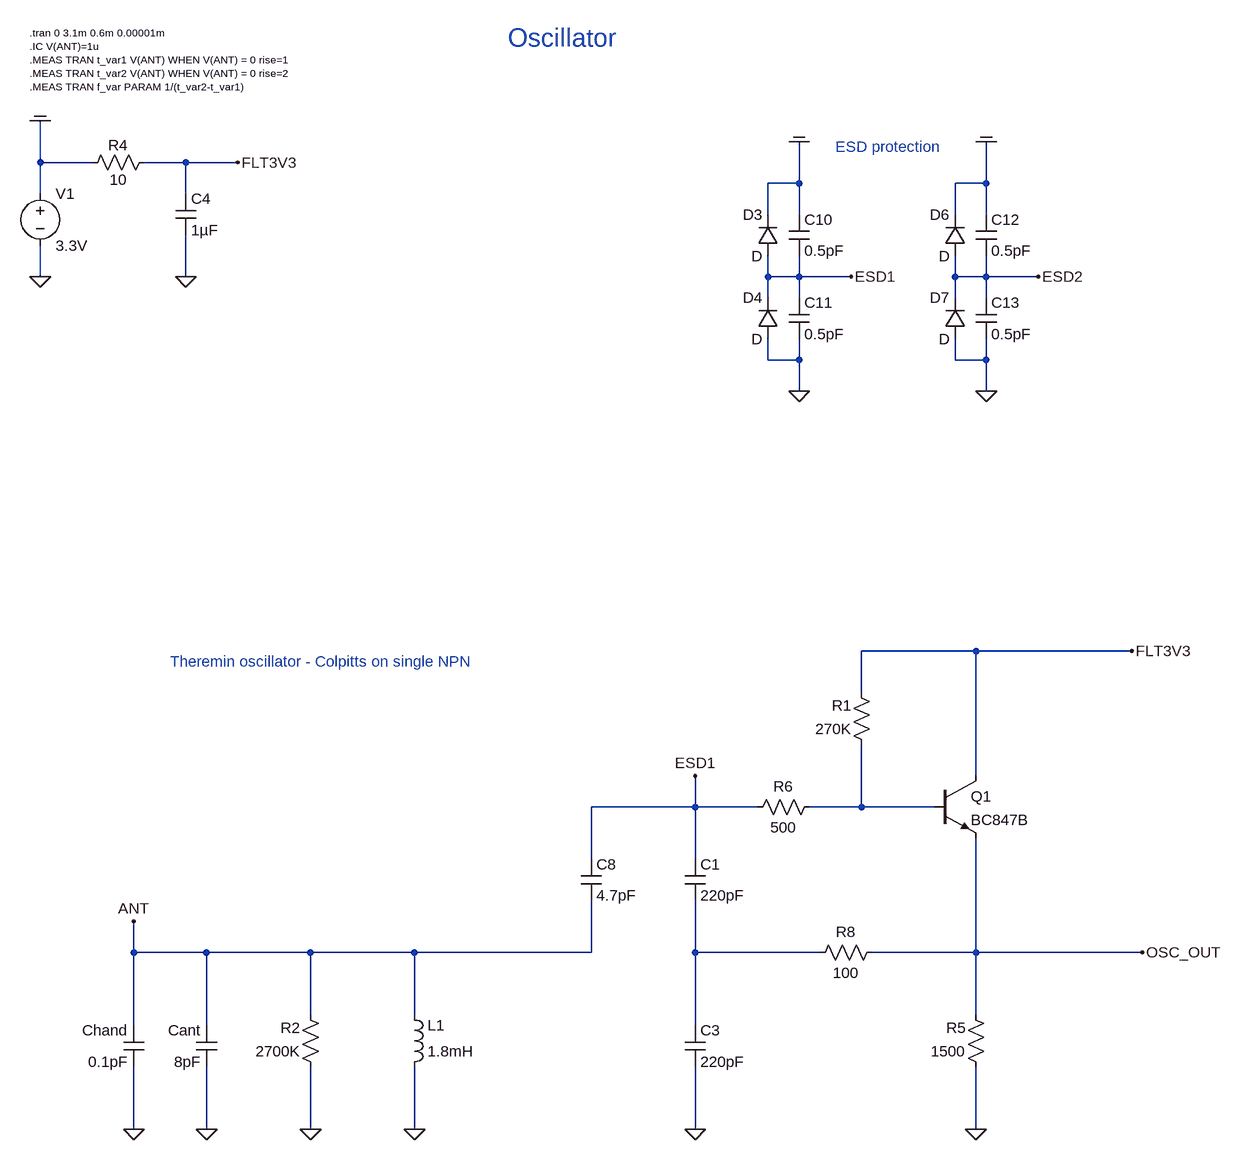
[diagram p0: schematic 2020_npn_no_pnp_osc_v16.asc]
2020_npn_no_pnp_osc_v16.asc, the LTspice schematic file:
Version 4
SHEET 1 2908 2724
WIRE -1056 -336 -1056 -400
WIRE -976 -336 -1056 -336
WIRE -832 -336 -896 -336
WIRE -752 -336 -832 -336
WIRE 112 -304 112 -368
WIRE 112 -304 64 -304
WIRE 400 -304 400 -368
WIRE 400 -304 352 -304
WIRE -1056 -288 -1056 -336
WIRE -832 -288 -832 -336
WIRE 64 -256 64 -304
WIRE 112 -256 112 -304
WIRE 352 -256 352 -304
WIRE 400 -256 400 -304
WIRE -1056 -160 -1056 -208
WIRE -832 -160 -832 -224
WIRE 64 -160 64 -192
WIRE 112 -160 112 -192
WIRE 112 -160 64 -160
WIRE 192 -160 112 -160
WIRE 352 -160 352 -192
WIRE 400 -160 400 -192
WIRE 400 -160 352 -160
WIRE 480 -160 400 -160
WIRE 64 -128 64 -160
WIRE 112 -128 112 -160
WIRE 352 -128 352 -160
WIRE 400 -128 400 -160
WIRE 64 -32 64 -64
WIRE 112 -32 112 -64
WIRE 112 -32 64 -32
WIRE 352 -32 352 -64
WIRE 400 -32 400 -64
WIRE 400 -32 352 -32
WIRE 112 16 112 -32
WIRE 400 16 400 -32
WIRE 384 416 208 416
WIRE 624 416 384 416
WIRE 208 480 208 416
WIRE 384 608 384 416
WIRE -48 656 -48 608
WIRE -48 656 -208 656
WIRE 48 656 -48 656
WIRE 208 656 208 560
WIRE 208 656 128 656
WIRE 320 656 208 656
WIRE -208 736 -208 656
WIRE -48 736 -48 656
WIRE -912 880 -912 832
WIRE -800 880 -912 880
WIRE -640 880 -800 880
WIRE -480 880 -640 880
WIRE -208 880 -208 800
WIRE -208 880 -480 880
WIRE -48 880 -48 800
WIRE 144 880 -48 880
WIRE 384 880 384 704
WIRE 384 880 224 880
WIRE 640 880 384 880
WIRE -640 976 -640 880
WIRE -480 976 -480 880
WIRE 384 976 384 880
WIRE -912 992 -912 880
WIRE -800 992 -800 880
WIRE -48 992 -48 880
WIRE -912 1152 -912 1056
WIRE -800 1152 -800 1056
WIRE -640 1152 -640 1056
WIRE -480 1152 -480 1056
WIRE -48 1152 -48 1056
WIRE 384 1152 384 1056
FLAG -1056 -160 0
FLAG -912 1152 0
FLAG -912 832 ANT
FLAG -1056 -400 COM
FLAG 112 16 0
FLAG 112 -368 COM
FLAG 192 -160 ESD1
FLAG 400 16 0
FLAG 400 -368 COM
FLAG 480 -160 ESD2
FLAG -800 1152 0
FLAG -48 608 ESD1
FLAG -832 -160 0
FLAG -640 1152 0
FLAG -480 1152 0
FLAG -752 -336 FLT3V3
FLAG 624 416 FLT3V3
FLAG 640 880 OSC_OUT
FLAG -48 1152 0
FLAG 384 1152 0
SYMBOL voltage -1056 -304 R0
WINDOW 123 0 0 Left 2
WINDOW 39 0 0 Left 2
SYMATTR InstName V1
SYMATTR Value 3.3V
SYMBOL ind -496 1072 M180
WINDOW 0 36 80 Left 2
WINDOW 3 36 40 Left 2
SYMATTR InstName L1
SYMATTR Value 1.8mH
SYMATTR SpiceLine Ipk=0.1 Rser=82 Rpar=20Meg Cpar=1.286pF
SYMBOL cap -896 992 M0
SYMATTR InstName Chand
SYMATTR Value 0.1pF
SYMBOL diode 80 -192 R180
WINDOW 0 24 64 Left 2
WINDOW 3 24 0 Left 2
SYMATTR InstName D3
SYMBOL diode 80 -64 R180
WINDOW 0 24 64 Left 2
WINDOW 3 24 0 Left 2
SYMATTR InstName D4
SYMBOL cap 96 -256 R0
SYMATTR InstName C10
SYMATTR Value 0.5pF
SYMBOL cap 96 -128 R0
SYMATTR InstName C11
SYMATTR Value 0.5pF
SYMBOL diode 368 -192 R180
WINDOW 0 24 64 Left 2
WINDOW 3 24 0 Left 2
SYMATTR InstName D6
SYMBOL diode 368 -64 R180
WINDOW 0 24 64 Left 2
WINDOW 3 24 0 Left 2
SYMATTR InstName D7
SYMBOL cap 384 -256 R0
SYMATTR InstName C12
SYMATTR Value 0.5pF
SYMBOL cap 384 -128 R0
SYMATTR InstName C13
SYMATTR Value 0.5pF
SYMBOL cap -784 992 M0
SYMATTR InstName Cant
SYMATTR Value 8pF
SYMBOL res -880 -352 R90
WINDOW 0 5 56 VBottom 2
WINDOW 3 27 56 VTop 2
SYMATTR InstName R4
SYMATTR Value 10
SYMBOL cap -848 -288 R0
SYMATTR InstName C4
SYMATTR Value 1µF
SYMBOL res 224 576 R180
WINDOW 0 31 76 Left 2
WINDOW 3 31 40 Left 2
SYMATTR InstName R1
SYMATTR Value 270K
SYMBOL res -624 1072 R180
WINDOW 0 31 76 Left 2
WINDOW 3 31 40 Left 2
SYMATTR InstName R2
SYMATTR Value 2700K
SYMBOL cap -64 736 R0
SYMATTR InstName C1
SYMATTR Value 220pF
SYMBOL cap -64 992 R0
SYMATTR InstName C3
SYMATTR Value 220pF
SYMBOL npn 320 608 R0
SYMATTR InstName Q1
SYMATTR Value BC847B
SYMBOL cap -224 736 R0
SYMATTR InstName C8
SYMATTR Value 4.7pF
SYMBOL res 32 672 R270
WINDOW 0 32 56 VTop 2
WINDOW 3 0 56 VBottom 2
SYMATTR InstName R6
SYMATTR Value 500
SYMBOL res 128 896 R270
WINDOW 0 32 56 VTop 2
WINDOW 3 0 56 VBottom 2
SYMATTR InstName R8
SYMATTR Value 100
SYMBOL res 400 1072 R180
WINDOW 0 31 76 Left 2
WINDOW 3 31 40 Left 2
SYMATTR InstName R5
SYMATTR Value 1500
TEXT -1072 -536 Left 1 !.tran 0 3.1m 0.6m 0.00001m\n.IC V(ANT)=1u\n.MEAS TRAN t_var1 V(ANT) WHEN V(ANT) = 0 rise=1\n.MEAS TRAN t_var2 V(ANT) WHEN V(ANT) = 0 rise=2\n.MEAS TRAN f_var PARAM 1/(t_var2-t_var1)
TEXT 168 -360 Left 2 ;ESD protection
TEXT -336 -528 Left 4 ;Oscillator
TEXT -856 432 Left 2 ;Theremin oscillator - Colpitts on single NPN

The netlist it stands for:
* 2020_npn_no_pnp_osc_v16.asc
V1 COM 0 3.3V
L1 0 ANT 1.8mH Ipk=0.1 Rser=82 Rpar=20Meg Cpar=1.286pF
Chand ANT 0 0.1pF
D3 ESD1 COM D
D4 0 ESD1 D
C10 COM ESD1 0.5pF
C11 ESD1 0 0.5pF
D6 ESD2 COM D
D7 0 ESD2 D
C12 COM ESD2 0.5pF
C13 ESD2 0 0.5pF
Cant ANT 0 8pF
R4 FLT3V3 COM 10
C4 FLT3V3 0 1µF
R1 N001 FLT3V3 270K
R2 0 ANT 2700K
C1 ESD1 N002 220pF
C3 N002 0 220pF
Q1 FLT3V3 N001 OSC_OUT 0 BC847B
C8 ESD1 ANT 4.7pF
R6 ESD1 N001 500
R8 N002 OSC_OUT 100
R5 0 OSC_OUT 1500
.model D D
.lib standard.dio
.model NPN NPN
.model PNP PNP
.lib standard.bjt
.tran 0 3.1m 0.6m 0.00001m
.IC V(ANT)=1u
.MEAS TRAN t_var1 V(ANT) WHEN V(ANT) = 0 rise=1
.MEAS TRAN t_var2 V(ANT) WHEN V(ANT) = 0 rise=2
.MEAS TRAN f_var PARAM 1/(t_var2-t_var1)
* ESD protection
* Oscillator
* Theremin oscillator - Colpitts on single NPN
.backanno
.end